# EAGLE schematic Cup4Lyfe (EAGLE 9.3.2)
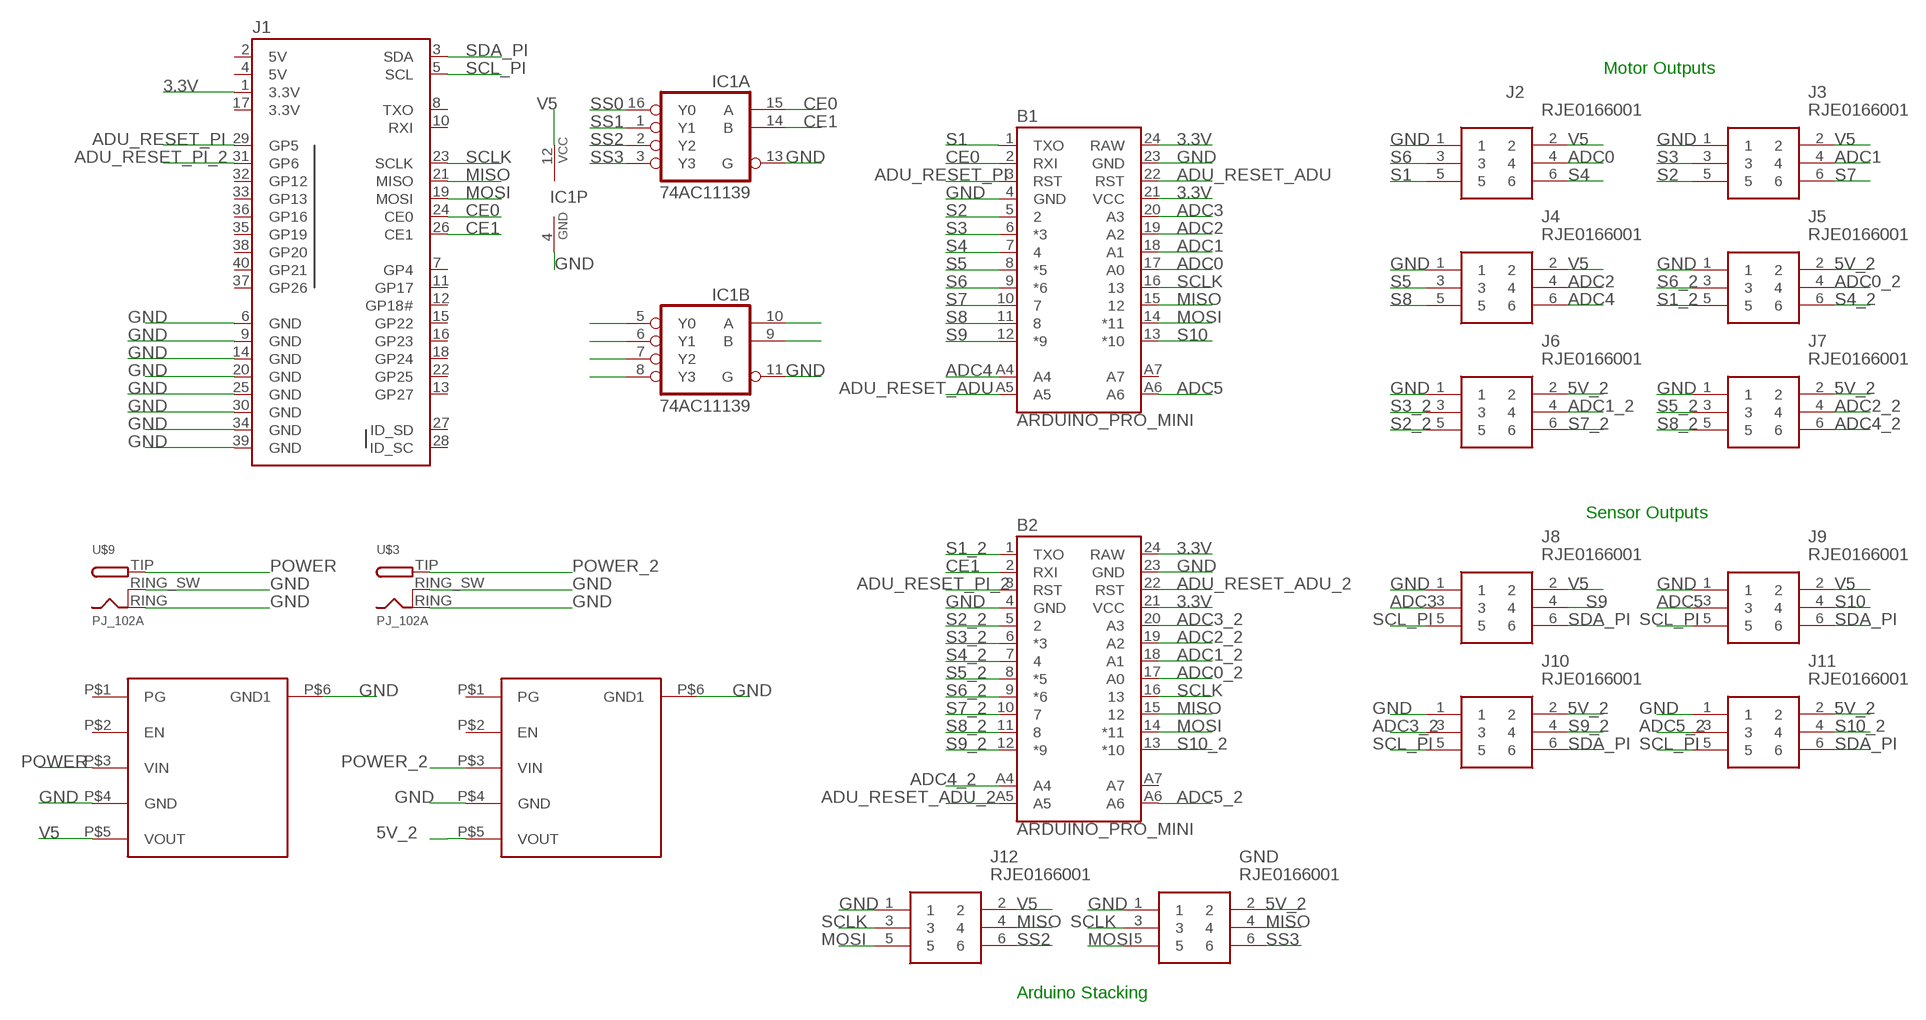
[diagram p0: schematic, sheet 1]

## Parts
B1  ARDUINO_PRO_MINI  [ARDUINO_PRO_MINI]
B2  ARDUINO_PRO_MINI  [ARDUINO_PRO_MINI]
GND  RJE0166001  [RJE0166001_1]
IC1  74AC11139  [DIL16]
J1  RASPBERRYPI-40-PIN-GPIO_PTH_NO_SHROUD  [2X20]
J2  RJE0166001  [RJE0166001_1]
J3  RJE0166001  [RJE0166001_1]
J4  RJE0166001  [RJE0166001_1]
J5  RJE0166001  [RJE0166001_1]
J6  RJE0166001  [RJE0166001_1]
J7  RJE0166001  [RJE0166001_1]
J8  RJE0166001  [RJE0166001_1]
J9  RJE0166001  [RJE0166001_1]
J10  RJE0166001  [RJE0166001_1]
J11  RJE0166001  [RJE0166001_1]
J12  RJE0166001  [RJE0166001_1]
U$1  D24V22F5  [D24V22F5]
U$2  D24V22F5  [D24V22F5]
U$3  PJ_102A  [PJ-102A]
U$9  PJ_102A  [PJ-102A]

## Nets
3.3V: B1.21(VCC) B1.24(RAW) B2.21(VCC) B2.24(RAW) J1.1(3.3V)
5V_2: GND.2 J5.2 J6.2 J7.2 J10.2 J11.2 U$1.P$5(VOUT)
ADC0: B1.17(A0) J2.4
ADC0_2: B2.17(A0) J5.4
ADC1: B1.18(A1) J3.4
ADC1_2: B2.18(A1) J6.4
ADC2: B1.19(A2) J4.4
ADC2_2: B2.19(A2) J7.4
ADC3: B1.20(A3) J8.3
ADC3_2: B2.20(A3) J10.3
ADC4: B1.A4 J4.6
ADC4_2: B2.A4 J7.6
ADC5: B1.A6 J9.3
ADC5_2: B2.A6 J11.3
ADU_RESET_ADU: B1.22(RST) B1.A5
ADU_RESET_ADU_2: B2.22(RST) B2.A5
ADU_RESET_PI: B1.3(RST) J1.29(GP5)
ADU_RESET_PI_2: B2.3(RST) J1.31(GP6)
CE0: B1.2(RXI) IC1.15(A:A) J1.24(CE0)
CE1: B2.2(RXI) IC1.14(A:B) J1.26(CE1)
GND: B1.4(GND) B1.23(GND) B2.4(GND) B2.23(GND) GND.1 IC1.4(P:GND) IC1.11(B:G) IC1.13(A:G) J1.6(GND) J1.9(GND) J1.14(GND) J1.20(GND) J1.25(GND) J1.30(GND) J1.34(GND) J1.39(GND) J2.1 J3.1 J4.1 J5.1 J6.1 J7.1 J8.1 J9.1 J10.1 J11.1 J12.1 U$1.P$4(GND) U$1.P$6(GND1) U$2.P$4(GND) U$2.P$6(GND1) U$3.RING(GND) U$3.RING_SW(GNDBREAK) U$9.RING(GND) U$9.RING_SW(GNDBREAK)
MISO: B1.15 B2.15 GND.4 J1.21(MISO) J12.4
MOSI: B1.14(*11) B2.14(*11) GND.5 J1.19(MOSI) J12.5
N$63: IC1.5(B:Y0)
N$64: IC1.6(B:Y1)
N$65: IC1.7(B:Y2)
N$66: IC1.8(B:Y3)
N$67: IC1.10(B:A)
N$68: IC1.9(B:B)
POWER: U$2.P$3(VIN) U$9.TIP(PWR)
POWER_2: U$1.P$3(VIN) U$3.TIP(PWR)
S1: B1.1(TXO) J2.5
S1_2: B2.1(TXO) J5.5
S2: B1.5 J3.5
S2_2: B2.5 J6.5
S3: B1.6(*3) J3.3
S3_2: B2.6(*3) J6.3
S4: B1.7 J2.6
S4_2: B2.7 J5.6
S5: B1.8(*5) J4.3
S5_2: B2.8(*5) J7.3
S6: B1.9(*6) J2.3
S6_2: B2.9(*6) J5.3
S7: B1.10 J3.6
S7_2: B2.10 J6.6
S8: B1.11 J4.5
S8_2: B2.11 J7.5
S9: B1.12(*9) J8.4
S9_2: B2.12(*9) J10.4
S10: B1.13(*10) J9.4
S10_2: B2.13(*10) J11.4
SCL_PI: J1.5(SCL) J8.5 J9.5 J10.5 J11.5
SCLK: B1.16 B2.16 GND.3 J1.23(SCLK) J12.3
SDA_PI: J1.3(SDA) J8.6 J9.6 J10.6 J11.6
SS0: IC1.16(A:Y0)
SS1: IC1.1(A:Y1)
SS2: IC1.2(A:Y2) J12.6
SS3: GND.6 IC1.3(A:Y3)
V5: IC1.12(P:VCC) J2.2 J3.2 J4.2 J8.2 J9.2 J12.2 U$2.P$5(VOUT)
Unconnected: B1.A7 B2.A7 J1.7(GP4) J1.8(TXO) J1.10(RXI) J1.11(GP17) J1.12(GP18#) J1.13(GP27) J1.15(GP22) J1.16(GP23) J1.18(GP24) J1.22(GP25) J1.27(ID_SD) J1.28(ID_SC) J1.32(GP12) J1.33(GP13) J1.35(GP19) J1.36(GP16) J1.37(GP26) J1.38(GP20) J1.40(GP21) U$1.P$1(PG) U$1.P$2(EN) U$2.P$1(PG) U$2.P$2(EN)

## Notes on the sheet
- Motor Outputs
- Sensor Outputs
- Arduino Stacking

## Power pins joined to a net without a drawn wire
3.3V: J1.17(3.3V)
5V: J1.2(5V) J1.4(5V)

## Library data of the parts
B1 B2 = JP:ARDUINO_PRO_MINI: SparkFun Pro Mini Pro Mini compatible footprint. Dimensions: 0.7 x 1.3" PCB Thickness: 0.8mm SparkFun Products: 3.3V/8MHz <https://www.sparkfun.com/products/11114> 5V/16MHz <https://www.sparkfun.com/products/11113>
GND J2-J12 = RJE0166001:RJE0166001: 6P6C modular jack, Single Port, No Shield Source: Datasheet <https://www.amphenolcanada.com/ProductSearch/pdf/RJE01_BRO.pdf>; DESCRIPTION: 6P6C modular jack, Single Port, No Shield; HEIGHT: mm; MANUFACTURER_NAME: Amphenol; MANUFACTURER_PART_NUMBER: RJE0166001
IC1 = 74ac-logic:74AC11139: Dual 2 to 4 line DECODER/DEMULTIPLEXER
J1 = JP:RASPBERRYPI-40-PIN-GPIO: Raspberry Pi GPIO Header 2x20 pin connector, as found on B, B+, A+ models. Both shrouded PTH and SMT versions available. SparkFun Products: GPIO Shrouded Header <https://www.sparkfun.com/products/13054>- PTH SparkFun Pi Wedge (Preassembled) <https://www.sparkfun.com/products/13717>
U$1 U$2 = JP:D24V22F5
U$3 U$9 = JP:PJ_102A